# EAGLE design PIC 16F877A Board_V3 (EAGLE 9.6.2)
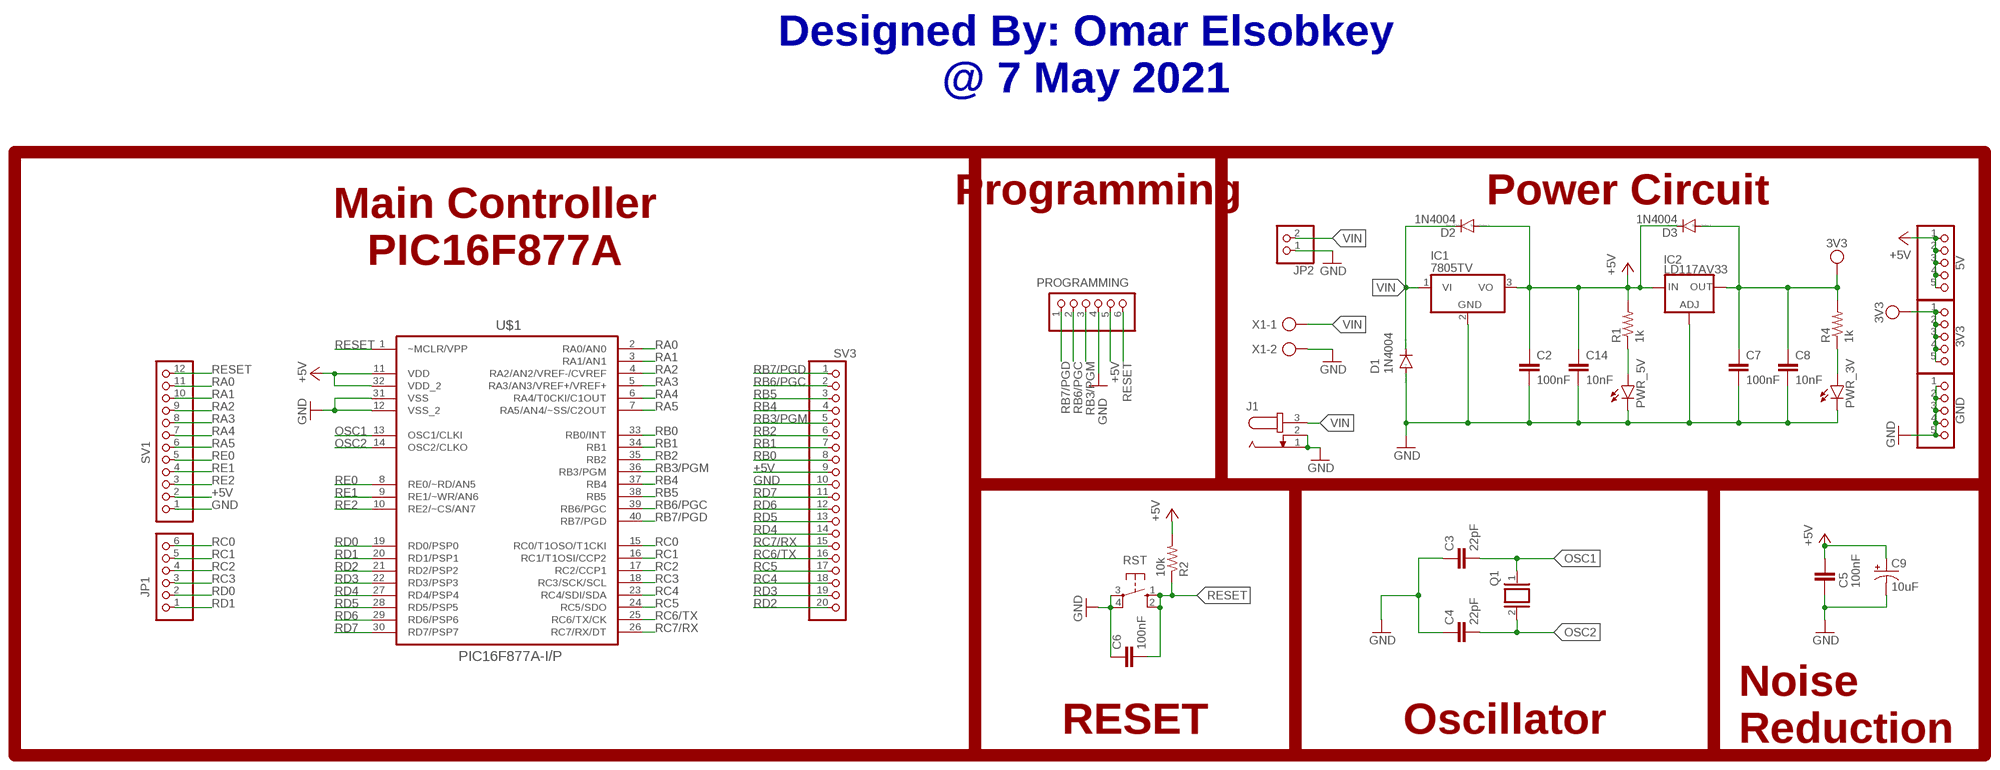
[diagram p0: schematic, sheet 1]

## Parts
3V3  PINHD-1X5  [1X05]
5V  PINHD-1X5  [1X05]
C2  100nF  C-EU025-025X050  [C025-025X050]
C3  22pF  C-EU025-025X050  [C025-025X050]
C4  22pF  C-EU025-025X050  [C025-025X050]
C5  100nF  C-EU025-025X050  [C025-025X050]
C6  100nF  C-EU025-025X050  [C025-025X050]
C7  100nF  C-EU025-025X050  [C025-025X050]
C8  10nF  C-EU025-025X050  [C025-025X050]
C9  10uF  10UF-POLAR-RADIAL-2.5MM-KIT-25V-20%  [CPOL-RADIAL-2.5MM-5MM-KIT]
C14  10nF  C-EU025-025X050  [C025-025X050]
D1  1N4004  [DO41-10]
D2  1N4004  [DO41-10]
D3  1N4004  [DO41-10]
GND  PINHD-1X5  [1X05]
IC1  7805TV  [TO220V]
IC2  LD117AV33  [TO220L1]
J1  JACK-PLUG0  [SPC4077]
JP1  PINHD-1X6  [1X06]
JP2  PINHD-1X2  [1X02]
PROGRAMMING  PINHD-1X6  [1X06]
PWR_3V  LED3MM  [LED3MM]
PWR_5V  LED3MM  [LED3MM]
Q1  XTAL/S  [QS]
R1  1k  RESISTORAXIAL-0.3  [AXIAL-0.3]
R2  10k  RESISTORAXIAL-0.3  [AXIAL-0.3]
R4  1k  RESISTORAXIAL-0.3  [AXIAL-0.3]
RST  10-XX  [B3F-10XX]
SV1  PINHD-1X12  [1X12]
SV3  PINHD-1X20  [1X20]
U$1  PIC16F877A-I/P  [16F877A]
X1  AK500/2-H  [AK500/2-H]

## Nets
3V3: 3V3.1 3V3.2 3V3.3 3V3.4 3V3.5 C7.1 C8.1 D3.A IC2.2(OUT) R4.P$2
+5V: 5V.1 5V.2 5V.3 5V.4 5V.5 C2.1 C5.2 C9.1(+) C14.1 D2.A D3.C IC1.3(VO) IC2.3(IN) PROGRAMMING.5 R1.P$2 R2.P$2 SV1.2 SV3.9 U$1.11(VDD) U$1.32(VDD_2)
GND: C2.2 C3.1 C4.1 C5.1 C6.1 C7.2 C8.2 C9.2(-) C14.2 D1.A GND.1 GND.2 GND.3 GND.4 GND.5 IC1.2(GND) IC2.1(ADJ) J1.1 J1.2 JP2.1 PROGRAMMING.4 PWR_3V.K(C) PWR_5V.K(C) RST.3(P) RST.4(P1) SV1.1 SV3.10 U$1.12(VSS_2) U$1.31(VSS) X1.2
N$1: PWR_3V.A R4.P$1
N$4: PWR_5V.A R1.P$1
OSC1: C3.2 Q1.1 U$1.13(OSC1/CLKI)
OSC2: C4.2 Q1.2 U$1.14(OSC2/CLKO)
RA0: SV1.11 U$1.2(RA0/AN0)
RA1: SV1.10 U$1.3(RA1/AN1)
RA2: SV1.9 U$1.4(RA2/AN2/VREF-/CVREF)
RA3: SV1.8 U$1.5(RA3/AN3/VREF+/VREF+)
RA4: SV1.7 U$1.6(RA4/T0CKI/C1OUT)
RA5: SV1.6 U$1.7(RA5/AN4/~SS/C2OUT)
RB0: SV3.8 U$1.33(RB0/INT)
RB1: SV3.7 U$1.34(RB1)
RB2: SV3.6 U$1.35(RB2)
RB3/PGM: PROGRAMMING.3 SV3.5 U$1.36(RB3/PGM)
RB4: SV3.4 U$1.37(RB4)
RB5: SV3.3 U$1.38(RB5)
RB6/PGC: PROGRAMMING.2 SV3.2 U$1.39(RB6/PGC)
RB7/PGD: PROGRAMMING.1 SV3.1 U$1.40(RB7/PGD)
RC0: JP1.6 U$1.15(RC0/T1OSO/T1CKI)
RC1: JP1.5 U$1.16(RC1/T1OSI/CCP2)
RC2: JP1.4 U$1.17(RC2/CCP1)
RC3: JP1.3 U$1.18(RC3/SCK/SCL)
RC4: SV3.18 U$1.23(RC4/SDI/SDA)
RC5: SV3.17 U$1.24(RC5/SDO)
RC6/TX: SV3.16 U$1.25(RC6/TX/CK)
RC7/RX: SV3.15 U$1.26(RC7/RX/DT)
RD0: JP1.2 U$1.19(RD0/PSP0)
RD1: JP1.1 U$1.20(RD1/PSP1)
RD2: SV3.20 U$1.21(RD2/PSP2)
RD3: SV3.19 U$1.22(RD3/PSP3)
RD4: SV3.14 U$1.27(RD4/PSP4)
RD5: SV3.13 U$1.28(RD5/PSP5)
RD6: SV3.12 U$1.29(RD6/PSP6)
RD7: SV3.11 U$1.30(RD7/PSP7)
RE0: SV1.5 U$1.8(RE0/~RD/AN5)
RE1: SV1.4 U$1.9(RE1/~WR/AN6)
RE2: SV1.3 U$1.10(RE2/~CS/AN7)
RESET: C6.2 PROGRAMMING.6 R2.P$1 RST.1(S) RST.2(S1) SV1.12 U$1.1(~MCLR/VPP)
VIN: D1.C D2.C IC1.1(VI) J1.3 JP2.2 X1.1

## Notes on the sheet
- Designed By: Omar Elsobkey
  @ 7 May 2021
- Programming | Power Circuit
- Main Controller
  PIC16F877A
- RESET | Oscillator
- Noise
  Reduction

## Library data of the parts
3V3 5V GND = pinhead:PINHD-1X5: PIN HEADER
C2-C8 C14 = rcl:C-EU: CAPACITOR, European symbol; SPICEPREFIX: C
C9 = SparkFun-Capacitors:10UF-POLAR: 10.0µF polarized capacitors A capacitor is a passive two-terminal electrical component used to store electrical energy temporarily in an electric field.; PROD_ID: CAP-08440
D1-D3 = diode:1N4004: DIODE general purpose rectifier, 1 A
IC1 = linear:78*: Positive VOLTAGE REGULATOR Source: http://cache.national.com/ds/LM/LM78L05.pdf http://www.fairchildsemi.com/ds/LM/LM7805.pdf
IC2 = v-reg:LD117A?*: Low drop fixed and adjustable positive voltage regulators 1 A Source: http://www.st.com/stonline/products/literature/ds/7194/ld1117axx.pdf
J1 = con-jack:JACK-PLUG: DC POWER JACK Power Jack, DC, Right Angle, Through Hole, Rated 5A at 16VDC, PC Terminals Distributor: Farnell (www.Farnell.de) Drawing: 84N1161.pdf / 84N1162.pdf Manufacturer: SPC Technology (www.spctechnology.com) Type: SPC4077 / SPC 4078; OC_FARNELL: unknown; OC_NEWARK: unknown
JP1 PROGRAMMING = pinhead:PINHD-1X6: PIN HEADER
JP2 = pinhead:PINHD-1X2: PIN HEADER
PWR_3V PWR_5V = led:LED: LED OSRAM: - CHIPLED LG R971, LG N971, LY N971, LG Q971, LY Q971, LO R971, LY R971 LH N974, LH R974 LS Q976, LO Q976, LY Q976 LO Q996 - Hyper CHIPLED LW Q18S LB Q993, LB Q99A, LB R99A - SideLED LS A670, LO A670, LY A670, LG A670, LP A670 LB A673, LV A673, LT A673, LW A673 LH A674 LY A675 LS A676, LA A676, LO A676, LY A676, LW A676 LS A679, LY A679, LG A679 - Hyper Micro SIDELED® LS Y876, LA Y876, LO Y876, LY Y876 LT Y87S - SmartLED LW L88C, LW L88S LB L89C, LB L89S, LG L890 LS L89K, LO L89K, LY L89K LS L896, LA L896, LO L896, LY L896 - TOPLED LS T670, LO T670, LY T670, LG T670, LP T670 LSG T670, LSP T670, LSY T670, LOP T670, LYG T670 LG T671, LOG T671, LSG T671 LB T673, LV T673, LT T673, LW T673 LH T674 LS T676, LA T676, LO T676, LY T676, LB T676, LH T676, LSB T676, LW T676 LB T67C, LV T67C, LT T67C, LS T67K, LO T67K, LY T67K, LW E67C LS E67B, LA E67B, LO E67B, LY E67B, LB E67C, LV E67C, LT E67C LW T67C LS T679, LY T679, LG T679 LS T770, LO T770, LY T770, LG T770, LP T770 LB T773, LV T773, LT T773, LW T773 LH T774 LS E675, LA E675, LY E675, LS T675 LS T776, LA T776, LO T776, LY T776, LB T776 LHGB T686 LT T68C, LB T68C - Hyper Mini TOPLED® LB M676 - Mini TOPLED Santana® LG M470 LS M47K, LO M47K, LY M47K Source: http://www.osram.convergy.de LUXEON: - LUMILED® LXK2-PW12-R00, LXK2-PW12-S00, LXK2-PW14-U00, LXK2-PW14-V00 LXK2-PM12-R00, LXK2-PM12-S00, LXK2-PM14-U00 LXK2-PE12-Q00, LXK2-PE12-R00, LXK2-PE12-S00, LXK2-PE14-T00, LXK2-PE14-U00 LXK2-PB12-K00, LXK2-PB12-L00, LXK2-PB12-M00, LXK2-PB14-N00, LXK2-PB14-P00, LXK2-PB14-Q00 LXK2-PR12-L00, LXK2-PR12-M00, LXK2-PR14-Q00, LXK2-PR14-R00 LXK2-PD12-Q00, LXK2-PD12-R00, LXK2-PD12-S00 LXK2-PH12-R00, LXK2-PH12-S00 LXK2-PL12-P00, LXK2-PL12-Q00, LXK2-PL12-R00 Source: www.luxeon.com KINGBRIGHT: KA-3528ASYC Source: www.kingbright.com
Q1 = special:XTAL/S: CRYSTAL
R1 R2 R4 = SparkFun-Resistors:RESISTOR: Generic Resistor Package
RST = switch-omron:10-XX: OMRON SWITCH; MPN: B3F-1000; OC_FARNELL: 176432; OC_NEWARK: 36M3542
SV1 = pinhead:PINHD-1X12: PIN HEADER
SV3 = pinhead:PINHD-1X20: PIN HEADER
U$1 = PIC - 16F877A:PIC16F877A-I/P: 8-Bit CMOS FLASH Microcontrollers Check prices <https://pricing.snapeda.com/parts/PIC16F877A-I/P/Microchip/view-part?ref=eda>; AVAILABILITY: Good; DESCRIPTION: PIC PIC® 16F Microcontroller IC 8-Bit 20MHz 14KB (8K x 14) FLASH 44-TQFP (10x10); MF: Microchip; MP: PIC16F877A-I/P; PACKAGE: DIP-40 Microchip; PRICE: None; PURCHASE-URL: https://pricing.snapeda.com/search/part/PIC16F877A-I/P/?ref=eda
X1 = con-ptr500:AK500/2-H: CONNECTOR Aug. 2004 / PTR Meßtechnik: Die Bezeichnung der Serie AK505 wurde geändert. Es handelt sich hierbei um AK500 in horizontaler Ausführung.; OC_FARNELL: unknown; OC_NEWARK: unknown

## Board
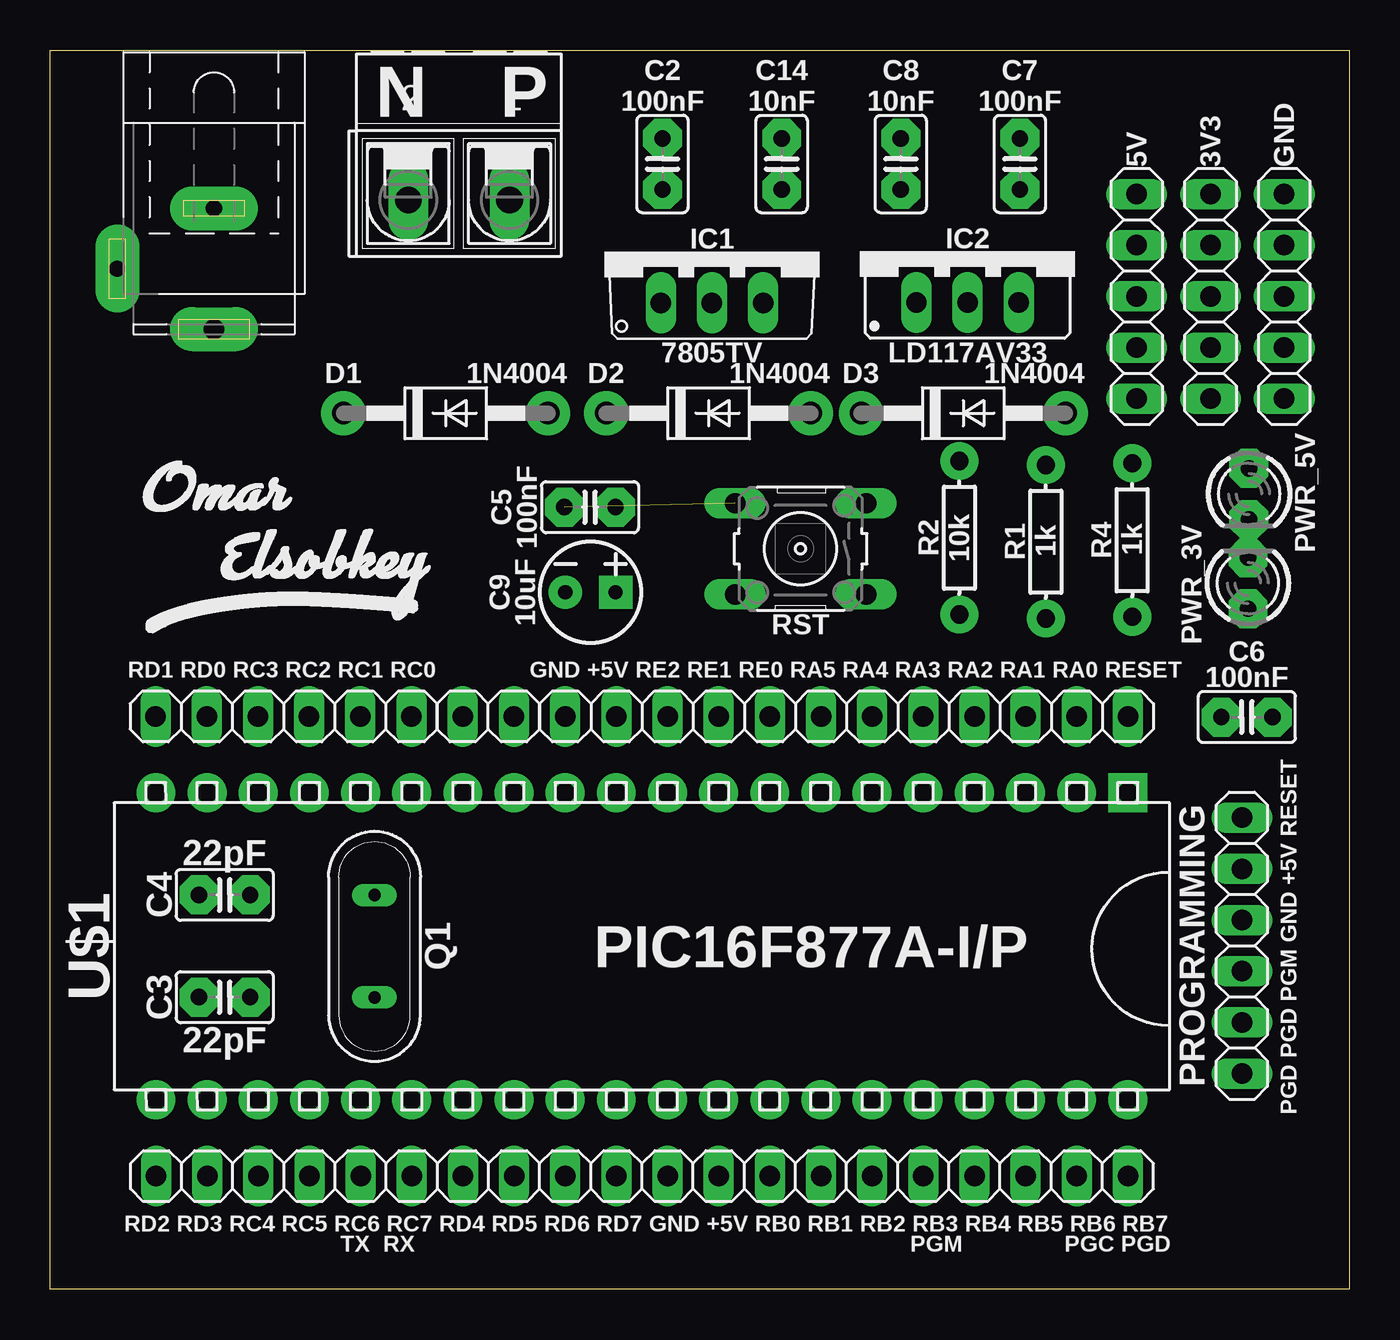
[diagram p1: board, top side]
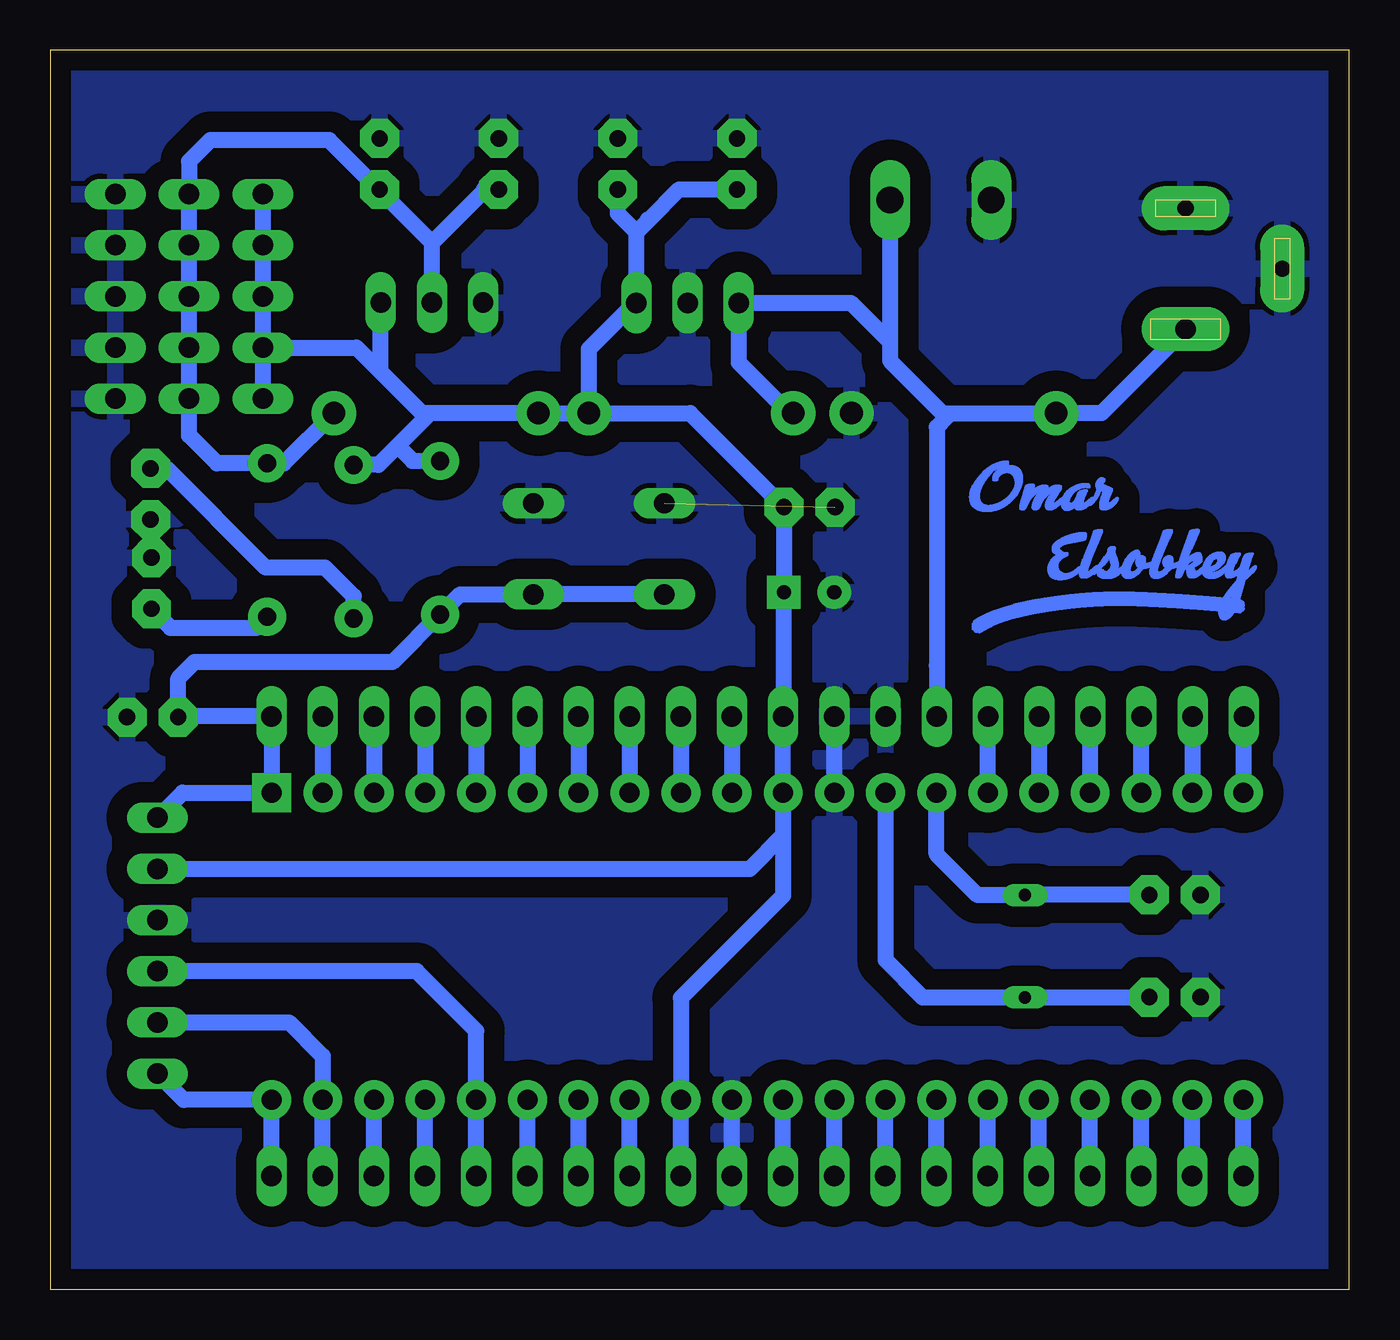
[diagram p2: board, bottom side, seen from below]

Size 64.5 x 61.5 mm. Coordinates in mm from the lower left corner, seen from the top.
Outline: 0,61.5 64.5,61.5 64.5,0 0,0 0,61.5
Copper layers (1*16): Top 0.035mm / dielectric 1.5mm / Bottom 0.035mm
Design rules "default *": minimum track width 0.8mm, minimum drill 0.6mm, track to track 0.6mm, track to pad 0.6mm, pad to pad 0.6mm, via to via 0.6mm, smd to smd 0.6mm, copper to edge 40mil, drill to drill 6mil, minimum pad ring 10mil, minimum via ring 8mil, stop-mask expansion 4mil, vias tented up to drill 0mil, thermal gap 10mil

### Footprints (pad centres in the part's own frame; a part is rotated, then mirrored left to right if it is on the bottom)
1X05 = drill 1.016 long: 1 -5.08,0; 2 -2.54,0; 3 0,0; 4 2.54,0; 5 5.08,0
C025-025X050 = drill 0.813 pad 1.93 octagon: 1 -1.27,0; 2 1.27,0
CPOL-RADIAL-2.5MM-5MM-KIT = drill 0.7 pad 1.651 square: 1 1.25,0 | drill 0.7 pad 1.651: 2 -1.25,0
DO41-10 = drill 1.118 pad 2.2: A 5.08,0; C -5.08,0
TO220V = drill 1.016 long: 1 -2.54,-2.54; 2 0,-2.54; 3 2.54,-2.54
TO220L1 = drill 1.016 long: 1 -2.54,-2.54; 2 0,-2.54; 3 2.54,-2.54
SPC4077 = drill 0.8 pad 2.184 long: 1 -3,0; 2 0,-4.8 | drill 1 pad 2.184 long: 3 3,0
1X06 = drill 1.016 long: 1 -6.35,0; 2 -3.81,0; 3 -1.27,0; 4 1.27,0; 5 3.81,0; 6 6.35,0
1X02 = drill 1.016 long: 1 -1.27,0; 2 1.27,0
LED3MM = drill 0.813 pad 1.93 octagon: A -1.27,0; K 1.27,0
QS = drill 0.61 long: 1 -2.54,0; 2 2.54,0
AXIAL-0.3 = drill 0.9 pad 1.88: P$1 -3.81,0; P$2 3.81,0
B3F-10XX = drill 1.016 long: 1 -3.251,2.261; 2 3.251,2.261; 3 -3.251,-2.261; 4 3.251,-2.261
1X12 = drill 1.016 long: 1 -13.97,0; 2 -11.43,0; 3 -8.89,0; 4 -6.35,0; 5 -3.81,0; 6 -1.27,0; 7 1.27,0; 8 3.81,0; 9 6.35,0; 10 8.89,0; 11 11.43,0; 12 13.97,0
1X20 = drill 1.016 long: 1 -24.13,0; 2 -21.59,0; 3 -19.05,0; 4 -16.51,0; 5 -13.97,0; 6 -11.43,0; 7 -8.89,0; 8 -6.35,0; 9 -3.81,0; 10 -1.27,0; 11 1.27,0; 12 3.81,0; 13 6.35,0; 14 8.89,0; 15 11.43,0; 16 13.97,0; 17 16.51,0; 18 19.05,0; 19 21.59,0; 20 24.13,0
16F877A = drill 0.991 pad 1.93 square: 1 -7.62,24.13 | drill 0.991 pad 1.93: 2 -7.62,21.59; 3 -7.62,19.05; 4 -7.62,16.51; 5 -7.62,13.97; 6 -7.62,11.43; 7 -7.62,8.89; 8 -7.62,6.35; 9 -7.62,3.81; 10 -7.62,1.27; 11 -7.62,-1.27; 12 -7.62,-3.81; 13 -7.62,-6.35; 14 -7.62,-8.89; 15 -7.62,-11.43; 16 -7.62,-13.97; 17 -7.62,-16.51; 18 -7.62,-19.05; 19 -7.62,-21.59; 20 -7.62,-24.13; 21 7.62,-24.13; 22 7.62,-21.59; 23 7.62,-19.05; 24 7.62,-16.51; 25 7.62,-13.97; 26 7.62,-11.43; 27 7.62,-8.89; 28 7.62,-6.35; 29 7.62,-3.81; 30 7.62,-1.27; 31 7.62,1.27; 32 7.62,3.81; 33 7.62,6.35; 34 7.62,8.89; 35 7.62,11.43; 36 7.62,13.97; 37 7.62,16.51; 38 7.62,19.05; 39 7.62,21.59; 40 7.62,24.13
AK500/2-H = drill 1.321 long: 1 -2.515,0; 2 2.515,0

### Placement (x,y rotation side)
3V3  57.62,49.29 90 top
5V  53.95,49.29 90 top
C2  30.4,55.86 90 top
C3  8.65,14.5 0 top
C4  8.65,19.57 0 top
C5  26.8,38.83 0 top
C6  59.42,28.4 180 top
C7  48.15,55.86 90 top
C8  42.23,55.86 90 top
C9  26.82,34.6 0 top
C14  36.32,55.86 90 top
D1  19.64,43.49 0 top
D2  32.69,43.49 0 top
D3  45.34,43.49 0 top
GND  61.27,49.29 90 top
IC1  32.86,51.51 0 top
IC2  45.55,51.52 0 top
J1  8.12,50.66 270 top
JP1  11.58,28.44 0 top
JP2  21.75,28.44 180 top
PROGRAMMING  59.18,17.06 90 top
PWR_3V  59.48,35.05 90 top
PWR_5V  59.52,39.48 270 top
Q1  16.1,17.02 90 top
R1  49.43,37.11 90 top
R2  45.14,37.31 90 top
R4  53.73,37.18 90 top
RST  37.25,36.76 180 top
SV1  39.54,28.44 0 top
SV3  29.38,5.61 180 top
U$1  29.38,17.02 270 top
U$2  [OMAR_ELSOBKEY_X1_T]  12.51,36.98 0 bottom
U$3  [OMAR_ELSOBKEY_X1_TN]  10.94,36.98 0 top
X1  20.29,54.08 180 top

### Tracks (layer width: path | path; a pad name or v marks a point on that pad's centre or on a via)
3V3
  Bottom 0.8: 3V3.1 3V3.2 3V3.3 3V3.4 3V3.5 57.62,55.98 56.55,57.05 50.65,57.05 48.19,54.59 C7.1 48.15,54.55 45.55,51.95 | IC2.2 45.55,51.95 | 42.98,54.59 C8.1 42.91,54.59 45.55,51.95 | 3V3.1 57.53,44.21 | D3.A 52.91,40.99 R4.P$2 56.22,40.99 57.62,42.39 3V3.1
+5V
  Bottom 0.8: D2.A 37.77,46.66 35.46,48.97 IC1.3 35.4,52.47 | D2.A D3.C 46.04,43.49 | 48.09,45.54 IC2.3 | 48.09,45.54 46.04,43.49 | 46.04,43.49 45.84,43.29 47.26,41.86 | 5V.5 5V.4 5V.3 5V.2 | 5V.2 5V.1 | 34.82,53.09 34.77,53.09 | C2.1 33.27,54.59 34.77,53.09 | 34.77,53.09 35.4,52.47 | 5V.2 49.3,46.75 48.09,45.54 | 45.43,41.4 R2.P$2 46.52,41.12 47.26,41.86 | 47.26,41.86 48.21,40.92 R1.P$2 | D2.A 32.73,43.49 C5.2 C9.1 28.09,34.59 28.09,28.41 SV1.2 U$1.11 28.11,22.52 | 28.11,22.52 28.11,19.54 33.19,14.46 U$1.32 33.19,6.38 SV3.9 | PROGRAMMING.5 29.77,20.87 28.11,22.52 | 35.4,52.47 36.32,53.4 C14.1
GND  (1 unrouted)
  Bottom 0.8: U$1.31 30.65,6.38 SV3.10 | U$1.12 SV1.1
  pour Bottom (isolate 1.016): -3.94,62.39 68.67,62.39 68.67,-4.35 68.49,-4.35 -3.94,-4.35
N$1
  Bottom 0.8: PWR_3V.A 58.53,32.83 55.85,32.83 54.27,32.83 R4.P$1
N$4
  Bottom 0.8: PWR_5V.A 58.72,40.75 53.8,35.83 50.86,35.83 49.43,34.4 R1.P$1
OSC1
  Bottom 0.8: U$1.13 23.03,16.34 21.19,14.48 Q1.1 9.94,14.48 C3.2
OSC2
  Bottom 0.8: U$1.14 20.49,21.6 18.45,19.57 Q1.2 16.09,19.57 C4.2
RA0
  Bottom 0.8: SV1.11 U$1.2
RA1
  Bottom 0.8: SV1.10 U$1.3
RA2
  Bottom 0.8: SV1.9 U$1.4
RA3
  Bottom 0.8: SV1.8 U$1.5
RA4
  Bottom 0.8: SV1.7 U$1.6
RA5
  Bottom 0.8: SV1.6 U$1.7
RB0
  Bottom 0.8: U$1.33 35.73,6.38 SV3.8
RB1
  Bottom 0.8: U$1.34 38.27,6.38 SV3.7
RB2
  Bottom 0.8: U$1.35 40.81,6.38 SV3.6
RB3/PGM
  Bottom 0.8: SV3.5 43.35,6.38 U$1.36 43.35,12.82 46.31,15.79 PROGRAMMING.3
RB4
  Bottom 0.8: U$1.37 45.89,6.38 SV3.4
RB5
  Bottom 0.8: U$1.38 48.43,6.38 SV3.3
RB6/PGC
  Bottom 0.8: SV3.2 50.97,6.38 U$1.39 50.97,11.57 52.65,13.25 PROGRAMMING.2
RB7/PGD
  Bottom 0.8: SV3.1 53.51,6.38 U$1.40 57.88,9.4 PROGRAMMING.1
RC0
  Bottom 0.8: U$1.15 17.93,24.65 JP1.6
RC1
  Bottom 0.8: U$1.16 15.39,24.65 JP1.5
RC2
  Bottom 0.8: U$1.17 12.85,24.65 JP1.4
RC3
  Bottom 0.8: U$1.18 10.31,24.65 JP1.3
RC4
  Bottom 0.8: U$1.23 10.33,6.38 SV3.18
RC5
  Bottom 0.8: U$1.24 12.87,6.38 SV3.17
RC6/TX
  Bottom 0.8: U$1.25 15.41,6.38 SV3.16
RC7/RX
  Bottom 0.8: U$1.26 17.95,6.38 SV3.15
RD0
  Bottom 0.8: U$1.19 7.77,24.65 JP1.2
RD1
  Bottom 0.8: U$1.20 5.23,24.65 JP1.1
RD2
  Bottom 0.8: U$1.21 5.25,6.38 SV3.20
RD3
  Bottom 0.8: U$1.22 7.79,6.38 SV3.19
RD4
  Bottom 0.8: U$1.27 20.49,6.38 SV3.14
RD5
  Bottom 0.8: U$1.28 23.03,6.38 SV3.13
RD6
  Bottom 0.8: U$1.29 25.57,6.38 SV3.12
RD7
  Bottom 0.8: U$1.30 28.11,6.38 SV3.11
RE0
  Bottom 0.8: SV1.5 U$1.8
RE1
  Bottom 0.8: SV1.4 U$1.9
RE2
  Bottom 0.8: SV1.3 U$1.10
RESET
  Bottom 0.8: U$1.1 SV1.12 58.12,28.44 C6.2 58.15,30.33 57.35,31.12 47.52,31.12 R2.P$1 44.14,34.5 RST.1 RST.2 | U$1.1 | PROGRAMMING.6 57.94,24.65 U$1.1
VIN
  Bottom 0.8: J1.3 12.3,43.49 D1.C 20.19,43.49 | 22.8,47.02 X1.1 22.8,48.97 | 22.8,47.02 22.8,46.1 20.19,43.49 | 20.19,43.49 19.99,43.29 20.48,42.8 JP2.2 20.48,30.97 | D2.C 27.79,43.49 30.32,46.02 IC1.1 24.75,48.97 22.8,47.02

### Text on the board
tNames: N | P | RD1 RD0 RC3 RC2 RC1 RC0 | GND +5V RE2 RE1 RE0 RA5 RA4 RA3 RA2 RA1 RA0 RESET | PGD PGD PGM GND +5V RESET | RD2 RD3 RC4 RC5 RC6 RC7 RD4 RD5 RD6 RD7 GND +5V RB0 RB1 RB2 RB3 RB4 RB5 RB6 RB7 | TX RX | PGM | PGC PGD